# Altium schematic sheet Sch1.SchDoc
size A4; SheetNumber: 1; SheetTotal: 1
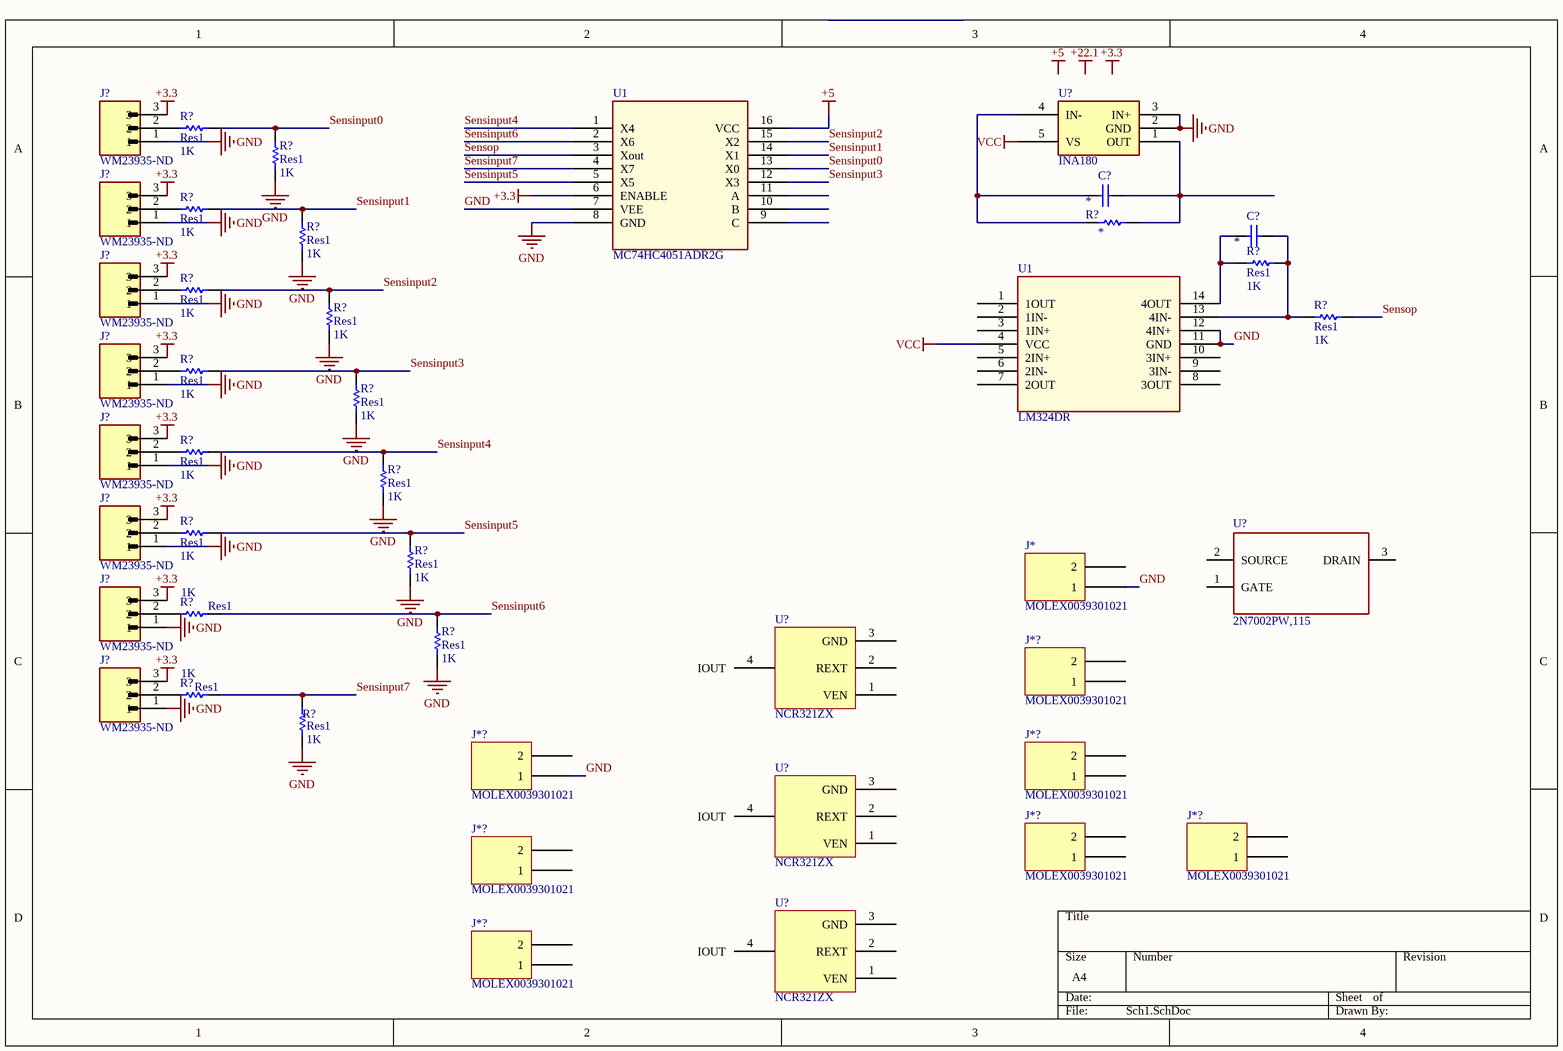
[diagram p0: Sch1.SchDoc]

## Parts
(Parts that share a designator on the sheet are numbered #1, #2 ... from top to bottom, then left to right.)
C?#1  Capacitor - Nonpolarized  [0603 - Capacitor]  (value not drawn)
C?#2  Capacitor - Nonpolarized  [0603 - Capacitor]  (value not drawn)
J*  MOLEX0039301021  [MOLEX0039301021]
J*?#1  MOLEX0039301021  [MOLEX0039301021]
J*?#2  MOLEX0039301021  [MOLEX0039301021]
J*?#3  MOLEX0039301021  [MOLEX0039301021]
J*?#4  MOLEX0039301021  [MOLEX0039301021]
J*?#5  MOLEX0039301021  [MOLEX0039301021]
J*?#6  MOLEX0039301021  [MOLEX0039301021]
J*?#7  MOLEX0039301021  [MOLEX0039301021]
J?#1  WM23935-ND  [MOLEX_39303037]
J?#2  WM23935-ND  [MOLEX_39303037]
J?#3  WM23935-ND  [MOLEX_39303037]
J?#4  WM23935-ND  [MOLEX_39303037]
J?#5  WM23935-ND  [MOLEX_39303037]
J?#6  WM23935-ND  [MOLEX_39303037]
J?#7  WM23935-ND  [MOLEX_39303037]
J?#8  WM23935-ND  [MOLEX_39303037]
R?#1  Res1  value 1K  [AXIAL-0.3]
R?#2  Res1  value 1K  [AXIAL-0.3]
R?#3  Res1  value 1K  [AXIAL-0.3]
R?#4  Resistor  [0603 - Resistor]  (value not drawn)
R?#5  Res1  value 1K  [AXIAL-0.3]
R?#6  Res1  value 1K  [AXIAL-0.3]
R?#7  Res1  value 1K  [AXIAL-0.3]
R?#8  Res1  value 1K  [AXIAL-0.3]
R?#9  Res1  value 1K  [AXIAL-0.3]
R?#10  Res1  value 1K  [AXIAL-0.3]
R?#11  Res1  value 1K  [AXIAL-0.3]
R?#12  Res1  value 1K  [AXIAL-0.3]
R?#13  Res1  value 1K  [AXIAL-0.3]
R?#14  Res1  value 1K  [AXIAL-0.3]
R?#15  Res1  value 1K  [AXIAL-0.3]
R?#16  Res1  value 1K  [AXIAL-0.3]
R?#17  Res1  value 1K  [AXIAL-0.3]
R?#18  Res1  value 1K  [AXIAL-0.3]
R?#19  Res1  value 1K  [AXIAL-0.3]
U1#1  MC74HC4051ADR2G  [MC74HC4051ADR2G]
U1#2  LM324DR  [LM324DR]
U?#1  INA180  [INA180]
U?#2  2N7002PW,115  [SOT65P210X110-3N]
U?#3  NCR321ZX  [NCR321ZX LED driver]
U?#4  NCR321ZX  [NCR321ZX LED driver]
U?#5  NCR321ZX  [NCR321ZX LED driver]

## Nets
+3.3: J?#1.3 J?#2.3 J?#3.3 J?#4.3 J?#5.3 J?#6.3 J?#7.3 J?#8.3 U1#1.6(ENABLE)
+5: U1#1.16(VCC)
GND: J*.1 J*?#2.1 J?#1.1 J?#2.1 J?#3.1 J?#4.1 J?#5.1 J?#6.1 J?#7.1 J?#8.1 R?#2.1 R?#5.1 R?#8.1 R?#11.1 R?#13.1 R?#15.1 R?#17.1 R?#19.1 U1#1.7(VEE) U1#1.8(GND) U1#2.11(GND) U1#2.12(4IN+) U?#1.2(GND) U?#1.3(IN+)
VCC: U1#2.4(VCC) U?#1.5(VS)
Sensinput0: R?#1.2 R?#2.2 U1#1.13(X0)
Sensinput1: R?#3.2 R?#5.2 U1#1.14(X1)
Sensinput2: R?#6.2 R?#8.2 U1#1.15(X2)
Sensinput3: R?#10.2 R?#11.2 U1#1.12(X3)
Sensinput4: R?#12.2 R?#13.2 U1#1.1(X4)
Sensinput5: R?#14.2 R?#15.2 U1#1.5(X5)
Sensinput6: R?#16.2 R?#17.2 U1#1.2(X6)
Sensinput7: R?#18.2 R?#19.2 U1#1.4(X7)
Sensop: R?#9.1 U1#1.3(Xout)
NetC?#1_1: C?#1.1 R?#4.2 U?#1.4(IN-)
NetC?#1_2: C?#1.2 R?#4.1 U?#1.1(OUT)
NetC?#2_1: C?#2.1 R?#7.2 U1#2.14(4OUT)
NetC?#2_2: C?#2.2 R?#7.1 R?#9.2 U1#2.13(4IN-)
NetJ?#1_2: J?#1.2 R?#1.1
NetJ?#2_2: J?#2.2 R?#3.1
NetJ?#3_2: J?#3.2 R?#6.1
NetJ?#4_2: J?#4.2 R?#10.1
NetJ?#5_2: J?#5.2 R?#12.1
NetJ?#6_2: J?#6.2 R?#14.1
NetJ?#7_2: J?#7.2 R?#16.1
NetJ?#8_2: J?#8.2 R?#18.1

Not connected (* = marked no-connect by the designer): J* 2; J*?#1 1 2; J*?#2 2; J*?#3 1 2; J*?#4 1 2; J*?#5 1 2; J*?#6 1 2; J*?#7 1 2; U1#1 9(C) 10(B) 11(A); U1#2 1(1OUT) 2(1IN-) 3(1IN+) 5(2IN+) 6(2IN-) 7(2OUT) 8(3OUT) 9(3IN-) 10(3IN+); U?#2 1(GATE) 2(SOURCE) 3(DRAIN); U?#3 1(VEN) 2(REXT) 3(GND) 4(IOUT); U?#4 1(VEN) 2(REXT) 3(GND) 4(IOUT); U?#5 1(VEN) 2(REXT) 3(GND) 4(IOUT)

## Notes on the sheet
- Labels drawn without touching a wire or pin: +3.3, +5, +22.1

## Library data of the parts
C?#1 C?#2 = Capacitor - Nonpolarized: Nonpolarized Capacitor; Supplier Part Number: *; Supplier: *; Manufacturer: *; Rating: *; Manufacturer Part Number: *; Value: *
J* J*?#1-J*?#7 = MOLEX0039301021: Connector Header Through Hole, Right Angle 2 pin 0.165" (4.20mm)
J?#1-J?#8 = WM23935-ND: Conn Power HDR 3 POS 4.2mm Solder RA Thru-Hole 3 Terminal 1 Port Mini-Fit Jr Bag; MP: 39303037; MF: Molex; Package: None; Purchase-URL: https://pricing.snapeda.com/search/part/39303037/?ref=eda; Check_prices: https://www.snapeda.com/parts/39303037/Molex/view-part/?ref=eda; Value: *; SnapEDA_Link: https://www.snapeda.com/parts/39303037/Molex/view-part/?ref=snap; ComponentLink1Description: Manufacturer name; ComponentLink1URL: Molex; ComponentLink2Description: Manufacturer part number; ComponentLink2URL: 0039303037; ComponentLink3Description: Supplier name; ComponentLink3URL: Digikey; ComponentLink4Description: Supplier part number; ComponentLink4URL: WM23935-ND
R?#1-R?#3 R?#5-R?#19 = Res1: Resistor; Published: 8-Jun-2000; LatestRevisionDate: 17-Jul-2002; LatestRevisionNote: Re-released for DXP Platform.; PackageReference: AXIAL-0.3; Publisher: Altium Limited; PackageDescription: Axial Device, Thru-Hole; 2 Leads; 0.3 in Pin Spacing
U1#1 = MC74HC4051ADR2G: 1 Circuit IC Switch 8:1 100Ohm 16-SOIC; Manufacturer Name: onsemi; Manufacturer Part Number: MC74HC4051ADR2G; Supplier Name: Digikey; Supplier Part Number: MC74HC4051ADR2GOSTR-ND
U1#2 = LM324DR: General Purpose Amplifier 4 Circuit 14-SOIC; Manufacturer Name: TI; Manufacturer Part Number: LM324DR; Supplier: Digikey; Supplier Part Number: 296-14597-2-ND
U?#1 = INA180: 0V to 26V Current Sense Amplifier; Manufacturer: Texas Instruments; Manufacturer Part Number: INA180A2IDBVR; Datasheet: https://www.ti.com/lit/ds/symlink/ina180.pdf; Supplier Part Number: 296-47653-1-ND; Supplier: Digikey
U?#2 = 2N7002PW,115: N-Channel 60V 310mA (Ta) 260mW (Ta) Surface Mount SOT-323; MF: Nexperia USA; SnapEDA_Link: https://www.snapeda.com/parts/2N7002PW,115/Nexperia%20USA%20Inc./view-part/2152859/?ref=snap; MP: 2N7002PW,115; Value: *; Digi-Key_Part_Number: 1727-4793-1-ND; Package: SOT-323 Nexperia; ComponentLink1Description: Manufacturer name; ComponentLink1URL: *Nexperia USA Inc.; ComponentLink2Description: Manufacturer part number; ComponentLink2URL: PMF370XN,115; ComponentLink3Description: Supplier name; ComponentLink3URL: Digikey; ComponentLink4Description: Supplier part #; ComponentLink4URL: 1727-5422-2-ND
U?#3-U?#5 = NCR321ZX: IC LED DRVR LIN PWM 250MA SOT223; Manufacturer name: Nexperia USA Inc.; Supplier 1: Digikey; ComponentLink1Description: Datasheet; ComponentLink1URL: https://assets.nexperia.com/documents/data-sheet/NCR320Z_NCR321Z.pdf; Supplier part number: 1727-8461-2-ND; Manufacturer part number: NCR321ZX
R?#4 = Resistor: Rating: *; Manufacturer Part Number: *; Manufacturer: *; Supplier Part Number: *; Supplier: *; Value: *